# Altium schematic sheet Mirror TurnSignal - Connectors and Power supply.SchDoc
size A4
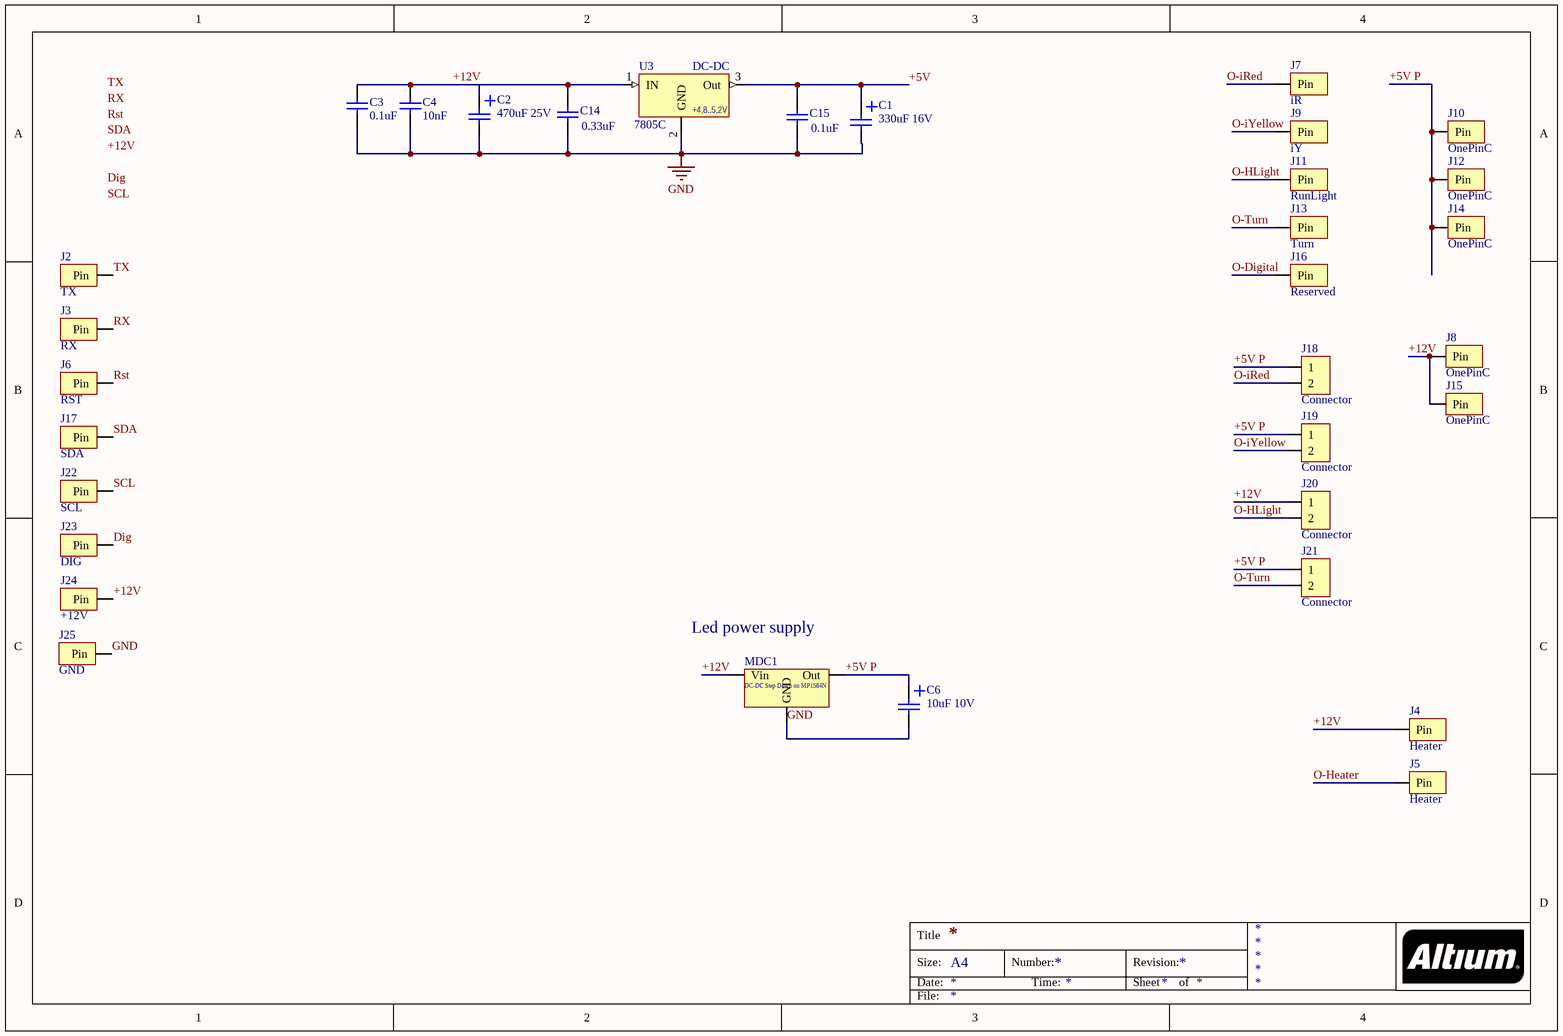
[diagram p0: Mirror TurnSignal - Connectors and Power supply.SchDoc]

## Parts
C1  330uF 16V  [Cap E p2.54mm D4xH8 (2p)]
C2  470uF 25V  [Cap E p2.54mm D4xH8 (2p)]
C3  0.1uF  [SMD 0805 (2012)]
C4  10nF  [SMD 0805 (2012)]
C6  10uF 10V  [Cap E p1.5mm D4xH8 (2p)]
C14  0.33uF  [SMD 1206 (3216)]
C15  0.1uF  [SMD 1206 (3216)]
J2  TX  [OnePin 0.7x2]
J3  RX  [OnePin 0.7x2]
J4  Heater  [OnePin 3x10mm Hole 0.7x8]
J5  Heater  [OnePin 3x10mm Hole 0.7x8]
J6  RST  [OnePin 0.7x2]
J7  iR  [OnePin 1.2x3]
J8  OnePinC  [OnePin 1.2x3]
J9  iY  [OnePin 1.2x3]
J10  OnePinC  [OnePin 1.2x3]
J11  RunLight  [OnePin 1.2x3]
J12  OnePinC  [OnePin 1.2x3]
J13  Turn  [OnePin 1.2x3]
J14  OnePinC  [OnePin 1.2x3]
J15  OnePinC  [OnePin 1.2x3]
J16  Reserved  [OnePin 1.2x3]
J17  SDA  [OnePin 0.7x2]
J18  Connector  [CWF-2]
J19  Connector  [CWF-2]
J20  Connector  [CWF-2]
J21  Connector  [CWF-2]
J22  SCL  [OnePin 0.7x2]
J23  DIG  [OnePin 0.7x2]
J24  +12V  [OnePin 0.7x2]
J25  GND  [OnePin 0.7x2]
MDC1  DC-DC  [DC-DC_MP1584N - spec1 (less pins)]  (value not drawn)
U3  7805C  V Out: +4,8..5,2V  [D-PAK]

## Nets
GND: C1.2 C2.2 C3.2 C4.2 C6.2 C14.2 C15.2 J25.1(Pin) MDC1.GND U3.2(GND)
+5V: C1.1 C15.1 U3.3(Out)
+5V P: C6.1 J10.1(Pin) J12.1(Pin) J14.1(Pin) J18.1 J19.1 J21.1 MDC1.OUT(Out)
+12V: C2.1 C3.1 C4.1 C14.1 J4.1(Pin) J8.1(Pin) J15.1(Pin) J20.1 J24.1(Pin) MDC1.IN(Vin) U3.1(IN)
Dig: J23.1(Pin)
O-Digital: J16.1(Pin)
O-Heater: J5.1(Pin)
O-HLight: J11.1(Pin) J20.2
O-iRed: J7.1(Pin) J18.2
O-iYellow: J9.1(Pin) J19.2
O-Turn: J13.1(Pin) J21.2
Rst: J6.1(Pin)
RX: J3.1(Pin)
SCL: J22.1(Pin)
SDA: J17.1(Pin)
TX: J2.1(Pin)

## Notes on the sheet
- (near U3) DC-DC
- (near MDC1) Led power supply
- Labels drawn without touching a wire or pin: +12V, Dig, Rst, RX, SCL, SDA, TX
- Title
- Size:
- Date:
- A4
- Number:
- Time:
- Revision:
- Sheet
- of
- File:
- (in symbol DC-DC MP1584N) DC-DC Step Down on MP1584N

## Library data of the parts
C1 C2 C6 = Cap Elecrolitic: Capacitor
C3 C4 C14 C15 = Cap SMD 0402-1812: Capacitor
J2-J17 J22-J25 = OnePin Connector: Only pad
J18-J21 = CWF-2 (R): CWF series
MDC1 = DC-DC MP1584N: DC-DC StepDown
U3 = 7805C: Voltage Regulator; Manufacturer: Интеграл; I output (A): 1; Max Voltage In (V): 35; Напряжение выход-вход (dropout): >2V; t: -10..+70°C; Case: D2PAK; Shema: http://tec.org.ru/_bd/5/57349922.jpg; Name: 7805C